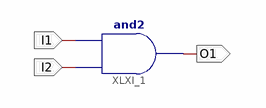
[diagram p0: schematic sheet 1]
// Xilinx ISE schematic asch.sch (artix7) as structural Verilog: 1 symbols, 3 ports
module asch (
  input  I1,
  input  I2,
  output O1
);

  and XLXI_1 (O1, I2, I1);
endmodule
